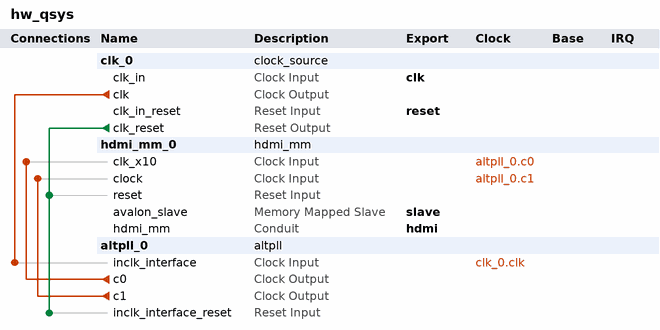
[diagram p0: system contents]
# Platform Designer (Qsys) system hw_qsys, MAX 10 10M50SAE144C8G
# Parameters at their usual value, and those the tool derives, are not listed.
package require -exact qsys 18.0
create_system hw_qsys
set_project_property DEVICE_FAMILY {MAX 10}
set_project_property DEVICE 10M50SAE144C8G

add_instance clk_0 clock_source 18.0
set_instance_parameter_value clk_0 clockFrequency 100000000
set_instance_parameter_value clk_0 resetSynchronousEdges DEASSERT

add_instance hdmi_mm_0 hdmi_mm 1.0
set_instance_parameter_value hdmi_mm_0 horz_back_porch 112
set_instance_parameter_value hdmi_mm_0 horz_front_porch 18
set_instance_parameter_value hdmi_mm_0 horz_pix 1024
set_instance_parameter_value hdmi_mm_0 horz_sync 60
set_instance_parameter_value hdmi_mm_0 vert_back_porch 112
set_instance_parameter_value hdmi_mm_0 vert_front_porch 18
set_instance_parameter_value hdmi_mm_0 vert_pix 600
set_instance_parameter_value hdmi_mm_0 vert_sync 60

add_instance altpll_0 altpll 18.0
set_instance_parameter_value altpll_0 CLK0_DIVIDE_BY 1
set_instance_parameter_value altpll_0 CLK0_MULTIPLY_BY 4
set_instance_parameter_value altpll_0 CLK1_DIVIDE_BY 5
set_instance_parameter_value altpll_0 CLK1_DUTY_CYCLE 50
set_instance_parameter_value altpll_0 CLK1_MULTIPLY_BY 4
set_instance_parameter_value altpll_0 CLK1_PHASE_SHIFT 0
set_instance_parameter_value altpll_0 INCLK0_INPUT_FREQUENCY 10000
set_instance_parameter_value altpll_0 PORT_ARESET PORT_UNUSED
set_instance_parameter_value altpll_0 PORT_LOCKED PORT_UNUSED
set_instance_parameter_value altpll_0 PORT_clk1 PORT_USED
set_instance_parameter_value altpll_0 PORT_clk2 PORT_UNUSED
set_instance_parameter_value altpll_0 PORT_clk3 PORT_UNUSED

# connections
add_connection altpll_0.c0 hdmi_mm_0.clk_x10 clock
add_connection altpll_0.c1 hdmi_mm_0.clock clock
add_connection clk_0.clk altpll_0.inclk_interface clock
add_connection clk_0.clk_reset altpll_0.inclk_interface_reset reset
add_connection clk_0.clk_reset hdmi_mm_0.reset reset

# exported interfaces
add_interface clk clock sink
set_interface_property clk EXPORT_OF clk_0.clk_in
add_interface hdmi conduit end
set_interface_property hdmi EXPORT_OF hdmi_mm_0.hdmi_mm
add_interface reset reset sink
set_interface_property reset EXPORT_OF clk_0.clk_in_reset
add_interface slave avalon slave
set_interface_property slave EXPORT_OF hdmi_mm_0.avalon_slave

set_interconnect_requirement {$system} qsys_mm.clockCrossingAdapter HANDSHAKE
set_interconnect_requirement {$system} qsys_mm.enableEccProtection FALSE
set_interconnect_requirement {$system} qsys_mm.insertDefaultSlave FALSE
set_interconnect_requirement {$system} qsys_mm.maxAdditionalLatency 1

save_system hw_qsys.qsys
